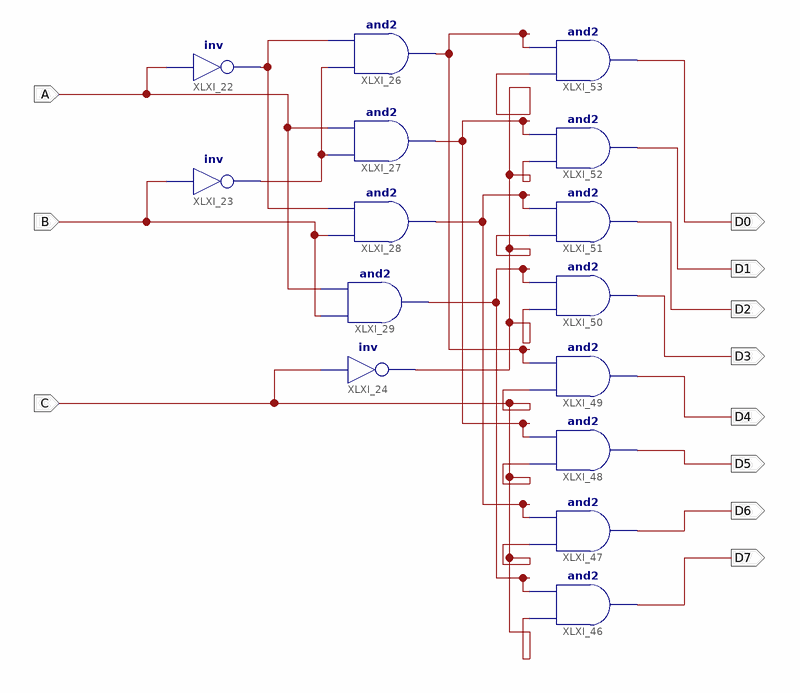
[diagram p0: schematic sheet 1]
// Xilinx ISE schematic D_74LS138.sch (kintex7) as structural Verilog: 15 symbols, 11 ports
module D_74LS138 (
  input  C,
  input  B,
  input  A,
  output D0,
  output D1,
  output D2,
  output D3,
  output D4,
  output D5,
  output D6,
  output D7
);

  wire XLXN_20, XLXN_33, XLXN_44, XLXN_46, XLXN_48, XLXN_53, XLXN_69;

  not XLXI_22 (XLXN_53, A);
  not XLXI_23 (XLXN_48, B);
  not XLXI_24 (XLXN_69, C);
  and XLXI_26 (XLXN_20, XLXN_48, XLXN_53);
  and XLXI_27 (XLXN_33, XLXN_48, A);
  and XLXI_28 (XLXN_44, B, XLXN_53);
  and XLXI_29 (XLXN_46, B, A);
  and XLXI_46 (D7, C, XLXN_46);
  and XLXI_47 (D6, C, XLXN_44);
  and XLXI_48 (D5, C, XLXN_33);
  and XLXI_49 (D4, C, XLXN_20);
  and XLXI_50 (D3, XLXN_69, XLXN_46);
  and XLXI_51 (D2, XLXN_69, XLXN_44);
  and XLXI_52 (D1, XLXN_69, XLXN_33);
  and XLXI_53 (D0, XLXN_69, XLXN_20);
endmodule
